# Altium schematic sheet USBCONN_C_16.SchDoc
size A3
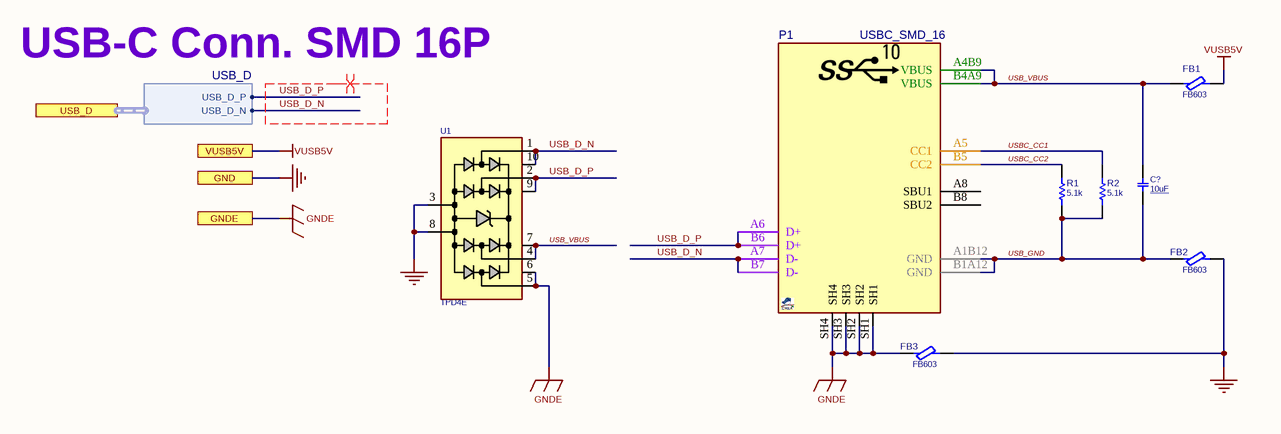
[diagram p0: USBCONN_C_16.SchDoc]

## Parts
C?  10uF  [C0402]
FB1  FB603  [L0603]
FB2  FB603  [L0603]
FB3  FB603  [L0603]
P1  USBC_SMD_16  [USBC_SMD_16_2171790001]
R1  5.1k  [R0402]
R2  5.1k  [R0402]
U1  TPD4E  [SON50_10_2510E]

## Ports
GND, GNDE, USB_D (harness USB_D), VUSB5V

## Harnesses
USB_D: USB_D_P, USB_D_N

## Nets
GND: FB2.2 FB3.2 U1.3 U1.8 ; port GND
GNDE: FB3.1 P1.SH1 P1.SH2 P1.SH3 P1.SH4 U1.5 U1.6 ; port GNDE
VUSB5V: FB1.2 ; port VUSB5V
USB_D_N: P1.A7(D-) P1.B7(D-) U1.1 U1.10 ; port USB_D.USB_D_N
USB_D_P: P1.A6(D+) P1.B6(D+) U1.2 U1.9 ; port USB_D.USB_D_P
USB_GND: C?.2 FB2.1 P1.A1B12(GND) P1.B1A12(GND) R1.1 R2.1
USB_VBUS: C?.1 FB1.1 P1.A4B9(VBUS) P1.B4A9(VBUS) U1.4 U1.7
USBC_CC1: P1.A5(CC1) R2.2
USBC_CC2: P1.B5(CC2) R1.2

Not connected (* = marked no-connect by the designer): P1 A8(SBU1) B8(SBU2)

## Layout directives
differential pair: USB_D_N, USB_D_P

## Notes on the sheet
- USB-C Conn. SMD 16P

## Library data of the parts
C? = CAP_SMD_MLCC: CAP, MLCC; PARAM: X5R, 20%; MANF: Murata; PARAM2: 10v; PRICE: -; DESC: -; MANF_P#: -; ASSEMBLY: ASSEMBLY; VALUE: 10uF
FB1-FB3 = FBEAD_SMD_BLM18KG601: FERRITE_Bead, 0603, 1.3A, 150mOhm, 600@100MHz; MANF: MURATA; MANF_P#: BLM18KG601SN1D; PARAM: 600@100MHz; PARAM2: 1.3A, 150mOhm; PRICE: 0.1$; VALUE: FB603
P1 = CONN_USBC_SMD_16_2171790001: CONN, USB, Type C, USB 2.0, Right-Angle, SMD; MANF: MOLEX; PARAM: 5A; Price: 1.5$; MANF_P#: 2171790001; Value: USBC_SMD_16
R1 R2 = RES_SMD: RESISTOR, SMD; PARAM: 0.063W; DESC: DESCRIPTION; DIST#: MOUSER; PARAM2: 1%; MANF_P#: -; MANF: -; ASSEMBLY: ASSEMBLY; PRICE: 100= 0.5$; VALUE: 5.1k
U1 = TVS_X4_TPD4E05U06: TVS, ESD PROTECT, 4CH,; MANF_P#: TPD4E05U06DQA; MANF: Texas Instruments; PARAM2: 6.5Vbr, 0.4pF, –40°~125°C; PARAM: ±12-kV ContactD, ±15-kVAirD; PRICE: 0.6$; VALUE: TPD4E